# EasyEDA schematic SCH_Robo_2025-09-25.json
TITLE: Sheet_1; REV: 1.0; Date: 2025-08-13; Sheet: 1/1; Drawn By: arvuntiwari; Company: Your Company
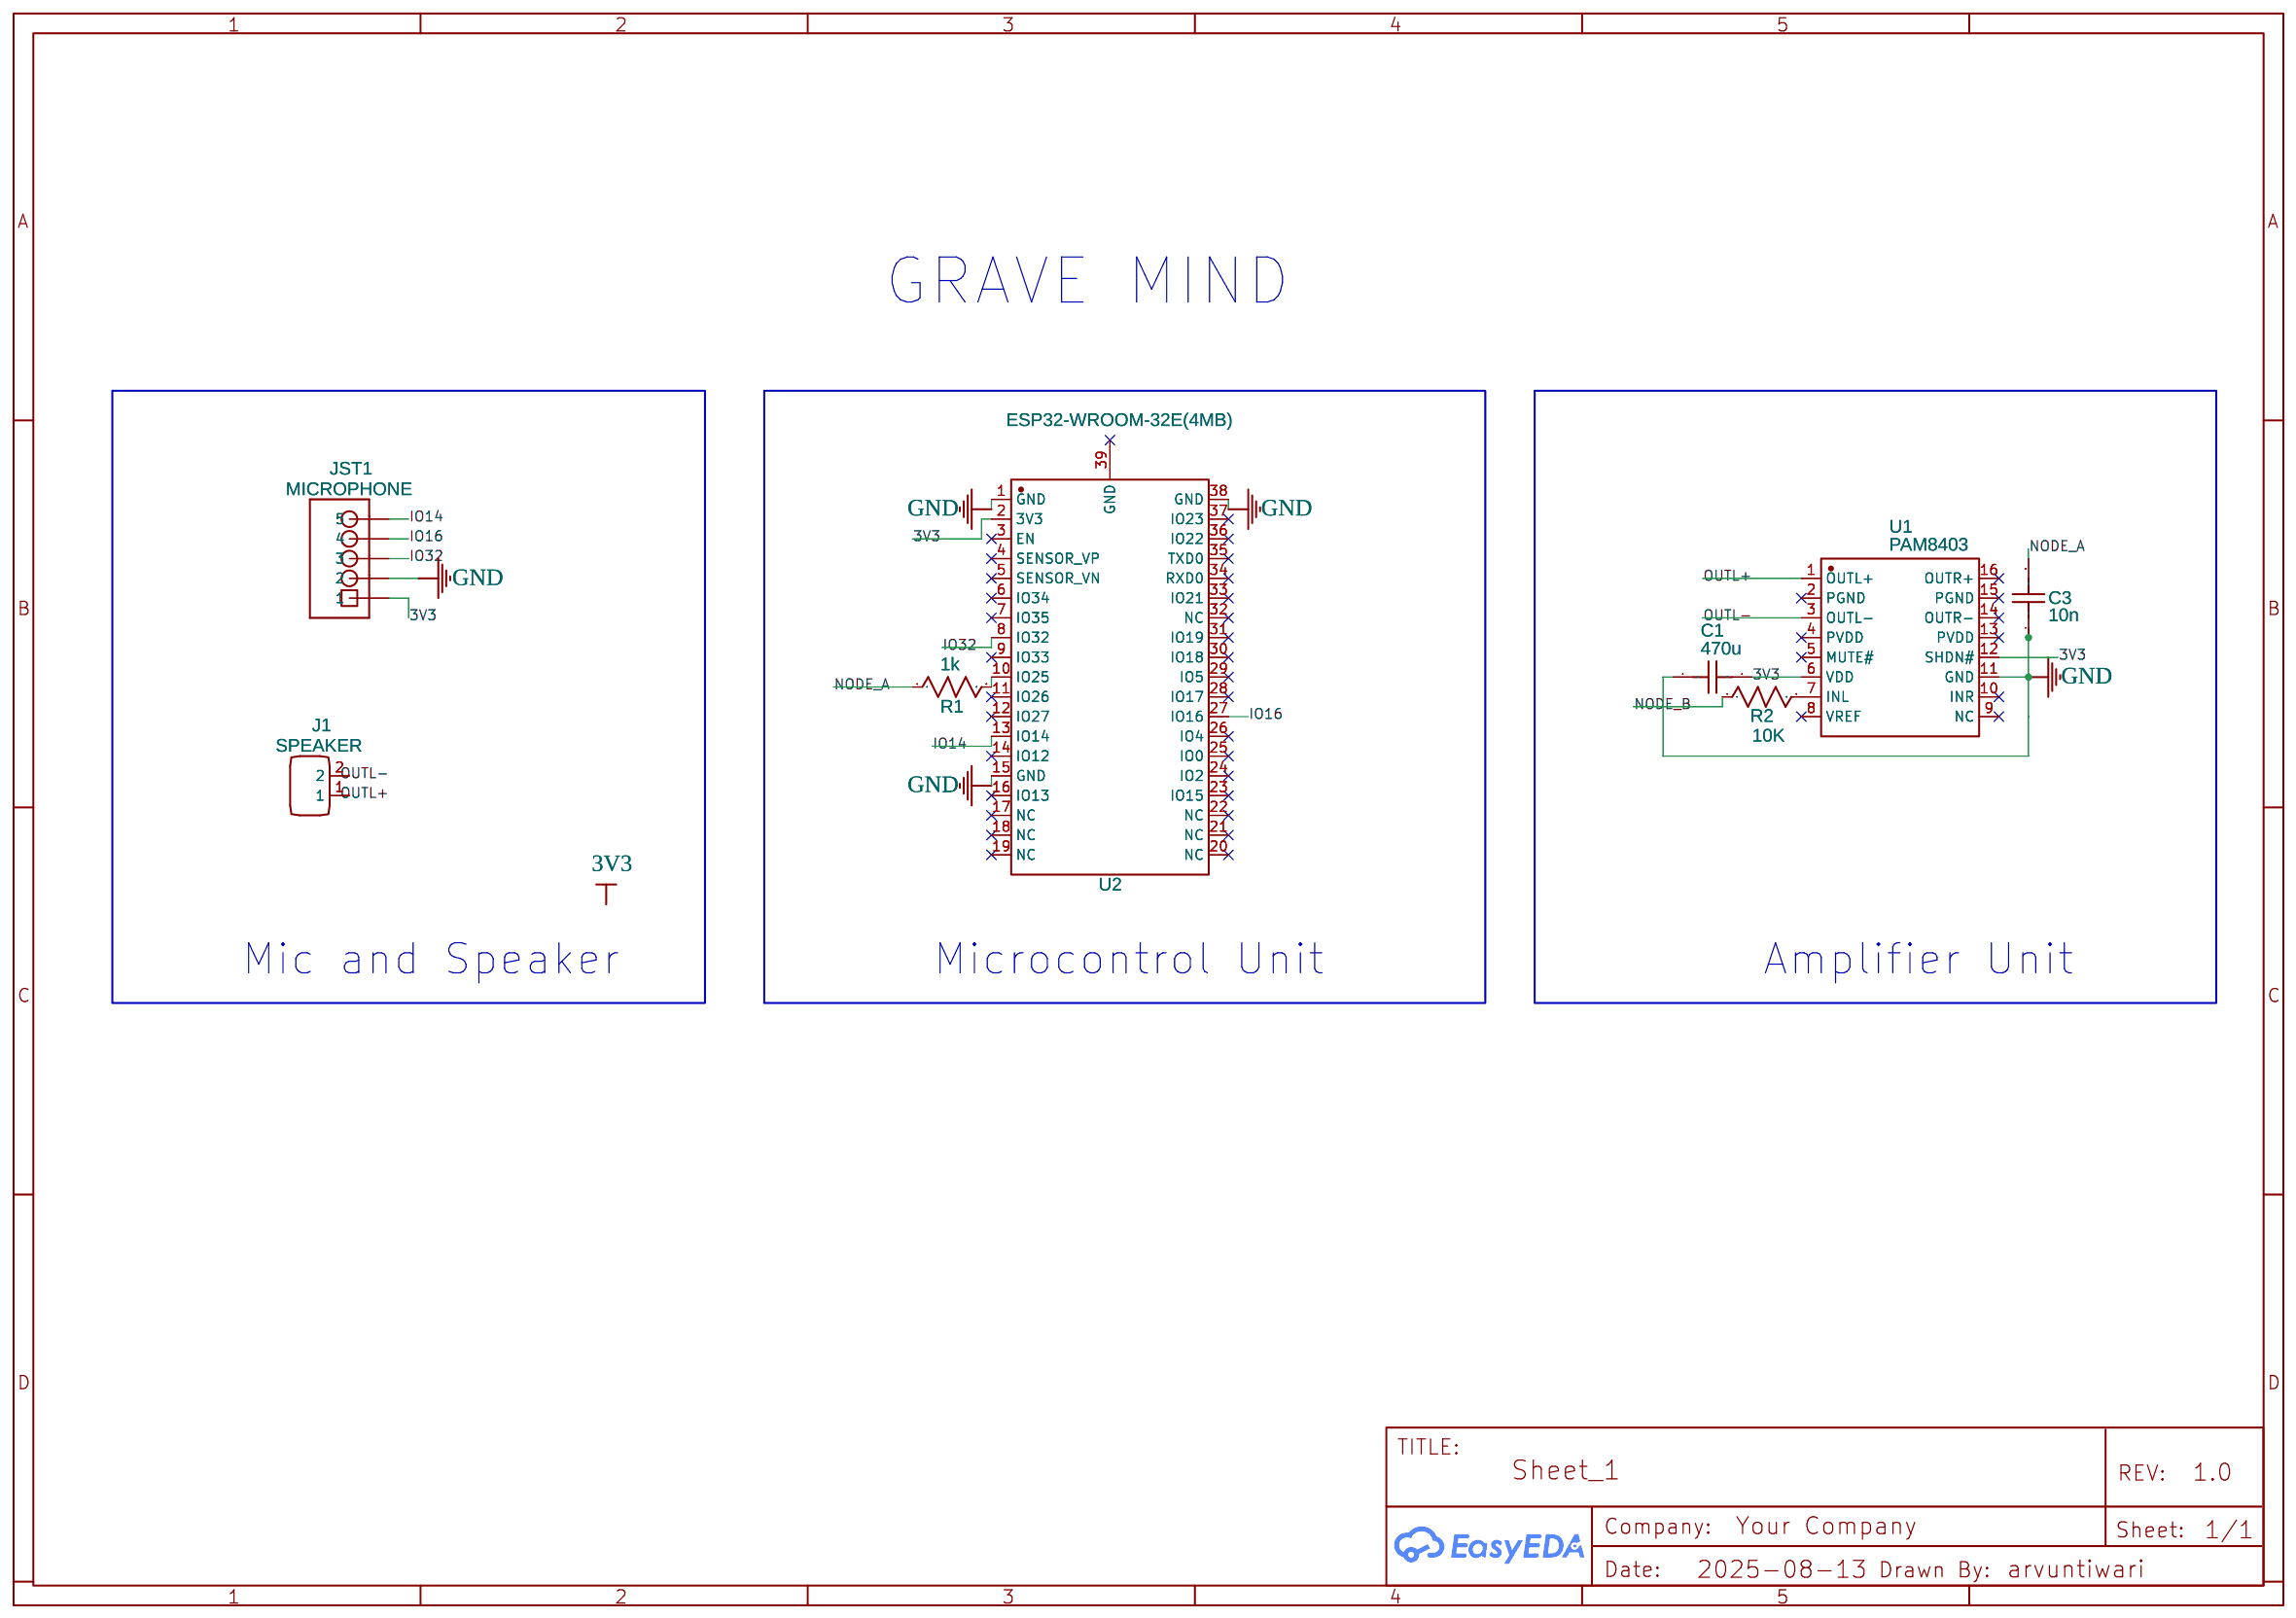
[diagram p0: schematic sheet]

## Parts
C1  470u  [C0603]
C3  10n  [C0603]
J1  SPEAKER  [JST 2 PIN FEMALE]
JST1  MICROPHONE  [JST_XH_5_PIN_TOP_ENTRY]
R1  1k  [R0603]
R2  10K  [R0603]
U1  PAM8403  [SOP-16_L10.0-W3.9-P1.27-LS6.0-BL]
U2  ESP32-WROOM-32E(4MB)  [WIFI-SMD_ESP32-WROOM-32E]

## Library data of the parts
C1 C3 = C_0603_US: Contributor: LCEDA_Lib
J1 = JST 2pin Female: Contributor: matthijssmit
JST1 = JST_5-PIN_Female_Connector: Contributor: fabiano.riccardi
R1 R2 = R_0603_US: Contributor: LCEDA_Lib
U1 = PAM8403: Contributor: lcsc; Supplier: LCSC; Supplier Part: C5122557; Manufacturer: Slkor(萨科微); JLCPCB Part Class: Extended Part
U2 = ESP32-WROOM-32E(4MB): Contributor: LCSC; Supplier: LCSC; Supplier Part: C701341; Manufacturer: ESPRESSIF(乐鑫); Manufacturer Part: ESP32-WROOM-32E-N4; JLCPCB Part Class: Extended Part

## Nets
3V3: C1.2 JST1.1 U1.6(VDD) U1.12(SHDN#) U2.2(3V3)
GND: C1.1 C3.1 JST1.2 U1.11(GND) U2.1(GND) U2.15(GND) U2.38(GND)
IO14: JST1.5 U2.13(IO14)
IO16: JST1.4 U2.27(IO16)
IO32: JST1.3 U2.8(IO32)
NODE_A: C3.2 R1.1
NODE_B: R2.1
OUTL+: J1.1 U1.1(OUTL+)
OUTL-: J1.2 U1.3(OUTL-)
Net-(R1-2): R1.2 U2.10(IO25)
Net-(R2-2): R2.2 U1.7(INL)

Not connected (* = marked no-connect by the designer): U1 2(PGND)* 4(PVDD)* 5(MUTE#)* 8(VREF)* 9(NC)* 10(INR)* 13(PVDD)* 14(OUTR-)* 15(PGND)* 16(OUTR+)*; U2 3(EN)* 4(SENSOR_VP)* 5(SENSOR_VN)* 6(IO34)* 7(IO35)* 9(IO33)* 11(IO26)* 12(IO27)* 14(IO12)* 16(IO13)* 17(NC)* 18(NC)* 19(NC)* 20(NC)* 21(NC)* 22(NC)* 23(IO15)* 24(IO2)* 25(IO0)* 26(IO4)* 28(IO17)* 29(IO5)* 30(IO18)* 31(IO19)* 32(NC)* 33(IO21)* 34(RXD0)* 35(TXD0)* 36(IO22)* 37(IO23)* 39(GND)*

## Notes on the sheet
- GRAVE MIND
- Mic and Speaker
- Microcontrol Unit
- Amplifier Unit
